# EAGLE design extpower (EAGLE 6.2)
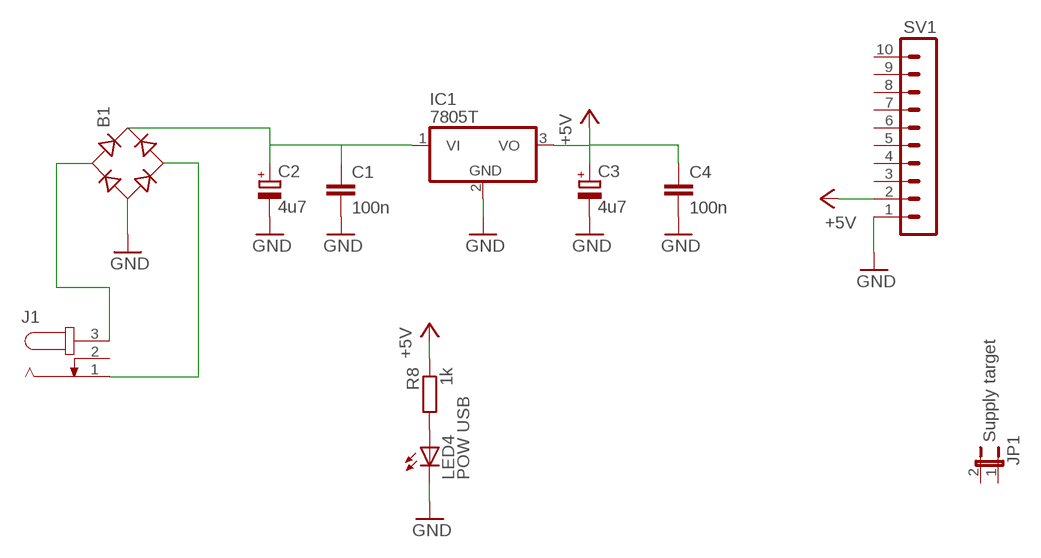
[diagram p0: schematic, sheet 1]

## Parts
B1  RB1A  [RB1A]
C1  100n  C-EU025-024X044  [C025-024X044]
C2  4u7  CPOL-EUTT2D5  [TT2D5]
C3  4u7  CPOL-EUTT2D5  [TT2D5]
C4  100n  C-EU025-024X044  [C025-024X044]
IC1  7805T  [TO220H]
J1  JACK-PLUG0  [SPC4077]
JP1  Supply target  JP1E  [JP1]
LED4  POW USB  LED3MM  [LED3MM]
R8  1k  R-EU_0207/10  [0207/10]
SV1  MA10-1W  [MA10-1W]

## Nets
+5V: C3.+ C4.1 IC1.3(VO) R8.1 SV1.2
GND: B1.- C1.2 C2.- C3.- C4.2 IC1.2(GND) LED4.K(C) SV1.1
N$1: B1.AC1 J1.3
N$2: B1.+ C1.1 C2.+ IC1.1(VI)
N$4: LED4.A R8.2
N$5: B1.AC2 J1.1
Unconnected: J1.2 JP1.1 JP1.2 SV1.3 SV1.4 SV1.5 SV1.6 SV1.7 SV1.8 SV1.9 SV1.10

## Library data of the parts
B1 = rectifier:RB1A: RECTIFIER 1 A
C1 C4 = rcl:C-EU: CAPACITOR, European symbol
C2 C3 = rcl:CPOL-EU: POLARIZED CAPACITOR, European symbol
IC1 = linear:78*: Positive VOLTAGE REGULATOR Source: http://cache.national.com/ds/LM/LM78L05.pdf http://www.fairchildsemi.com/ds/LM/LM7805.pdf
J1 = con-jack:JACK-PLUG: DC POWER JACK Power Jack, DC, Right Angle, Through Hole, Rated 5A at 16VDC, PC Terminals Distributor: Farnell (www.Farnell.de) Drawing: 84N1161.pdf / 84N1162.pdf Manufacturer: SPC Technology (www.spctechnology.com) Type: SPC4077 / SPC 4078
JP1 = jumper:JP1E: JUMPER
LED4 = led:LED: LED OSRAM: - CHIPLED LG R971, LG N971, LY N971, LG Q971, LY Q971, LO R971, LY R971 LH N974, LH R974 LS Q976, LO Q976, LY Q976 LO Q996 - Hyper CHIPLED LW Q18S LB Q993, LB Q99A, LB R99A - SideLED LS A670, LO A670, LY A670, LG A670, LP A670 LB A673, LV A673, LT A673, LW A673 LH A674 LY A675 LS A676, LA A676, LO A676, LY A676, LW A676 LS A679, LY A679, LG A679 - Hyper Micro SIDELED® LS Y876, LA Y876, LO Y876, LY Y876 LT Y87S - SmartLED LW L88C, LW L88S LB L89C, LB L89S, LG L890 LS L89K, LO L89K, LY L89K LS L896, LA L896, LO L896, LY L896 - TOPLED LS T670, LO T670, LY T670, LG T670, LP T670 LSG T670, LSP T670, LSY T670, LOP T670, LYG T670 LG T671, LOG T671, LSG T671 LB T673, LV T673, LT T673, LW T673 LH T674 LS T676, LA T676, LO T676, LY T676, LB T676, LH T676, LSB T676, LW T676 LB T67C, LV T67C, LT T67C, LS T67K, LO T67K, LY T67K, LW E67C LS E67B, LA E67B, LO E67B, LY E67B, LB E67C, LV E67C, LT E67C LW T67C LS T679, LY T679, LG T679 LS T770, LO T770, LY T770, LG T770, LP T770 LB T773, LV T773, LT T773, LW T773 LH T774 LS E675, LA E675, LY E675, LS T675 LS T776, LA T776, LO T776, LY T776, LB T776 LHGB T686 LT T68C, LB T68C - Hyper Mini TOPLED® LB M676 - Mini TOPLED Santana® LG M470 LS M47K, LO M47K, LY M47K Source: http://www.osram.convergy.de LUXEON: - LUMILED® LXK2-PW12-R00, LXK2-PW12-S00, LXK2-PW14-U00, LXK2-PW14-V00 LXK2-PM12-R00, LXK2-PM12-S00, LXK2-PM14-U00 LXK2-PE12-Q00, LXK2-PE12-R00, LXK2-PE12-S00, LXK2-PE14-T00, LXK2-PE14-U00 LXK2-PB12-K00, LXK2-PB12-L00, LXK2-PB12-M00, LXK2-PB14-N00, LXK2-PB14-P00, LXK2-PB14-Q00 LXK2-PR12-L00, LXK2-PR12-M00, LXK2-PR14-Q00, LXK2-PR14-R00 LXK2-PD12-Q00, LXK2-PD12-R00, LXK2-PD12-S00 LXK2-PH12-R00, LXK2-PH12-S00 LXK2-PL12-P00, LXK2-PL12-Q00, LXK2-PL12-R00 Source: www.luxeon.com KINGBRIGHT: KA-3528ASYC Source: www.kingbright.com
R8 = rcl:R-EU_: RESISTOR, European symbol
SV1 = con-lstb:MA10-1W: PIN HEADER

## Board
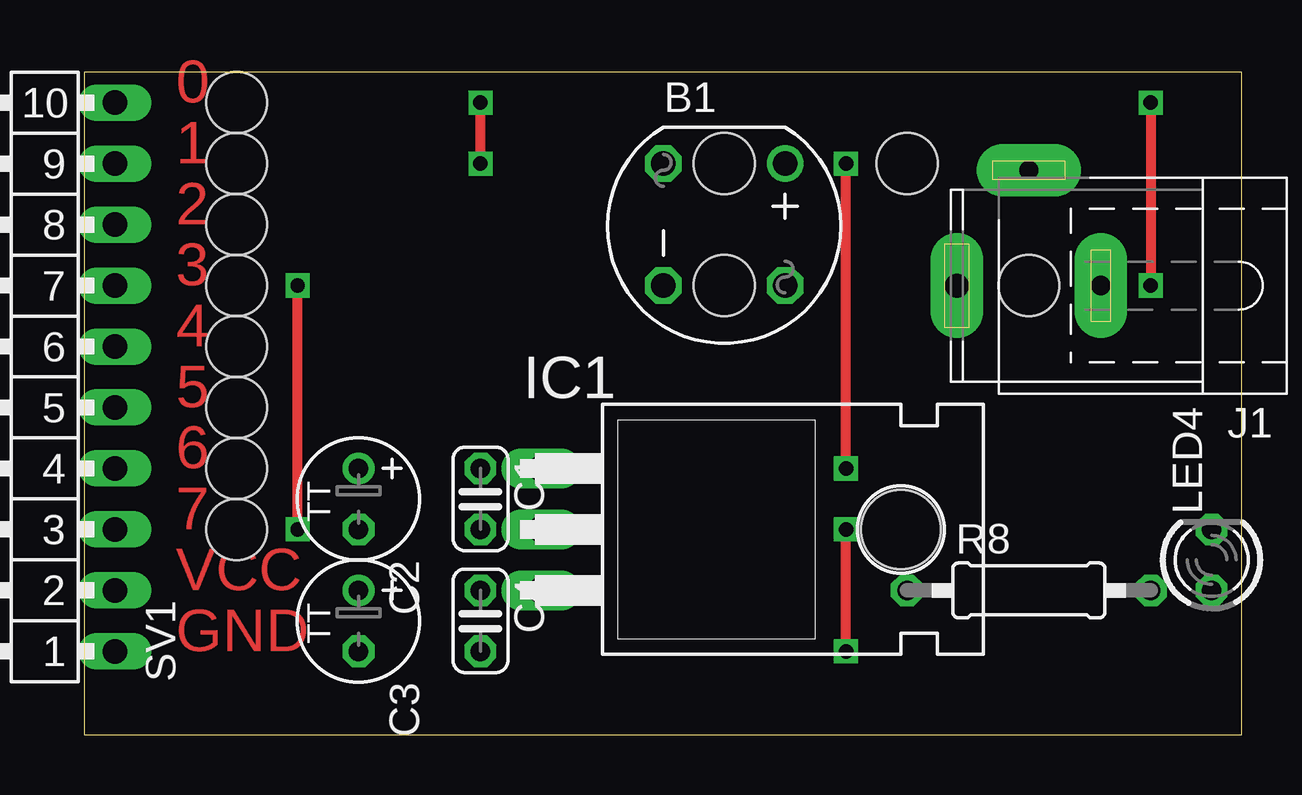
[diagram p1: board, top side]
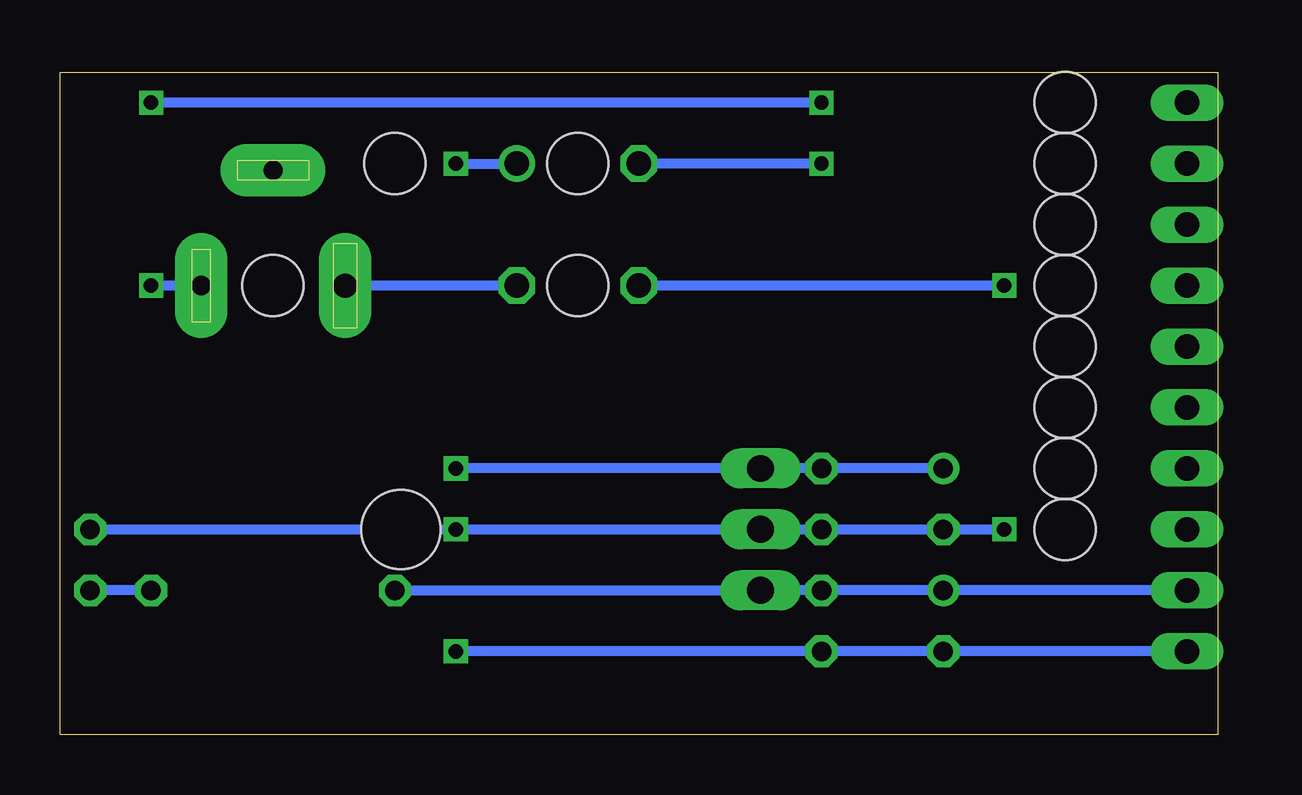
[diagram p2: board, bottom side, seen from below]

Size 48.25 x 27.61 mm. Coordinates in mm from the lower left corner, seen from the top.
Outline: 0,27.61 0,0 48.25,0 48.25,27.61 0,27.61
Copper layers (1*16): Top 0.035mm / dielectric 1.5mm / Bottom 0.035mm
Design rules: minimum track width 10mil, minimum drill 24mil, track to track 8mil, track to pad 8mil, pad to pad 8mil, via to via 8mil, smd to smd 8mil, copper to edge 40mil, drill to drill 8mil, minimum pad ring 10mil, minimum via ring 8mil, stop-mask expansion 4mil, vias tented up to drill 0mil, thermal gap 10mil
Holes 2.54 mm at 6.35,8.56 6.35,11.1 6.35,13.64 6.35,16.18 6.35,18.72 6.35,21.26 6.35,23.8 6.35,26.34 26.67,23.8 26.67,18.72 34.29,23.8 39.37,18.72

### Footprints (pad centres in the part's own frame; a part is rotated, then mirrored left to right if it is on the bottom)
RB1A = drill 1.016: + -2.54,2.54 | drill 1.016 octagon: - 2.54,-2.54; AC1 2.54,2.54; AC2 -2.54,-2.54
C025-024X044 = drill 0.813 octagon: 1 -1.27,0; 2 1.27,0
TT2D5 = drill 0.813: + -1.27,0 | drill 0.813 octagon: - 1.27,0
TO220H = drill 1.118 long: 1 -2.54,-10.16; 2 0,-10.16; 3 2.54,-10.16 | hole 3.302: 0,4.826
SPC4077 = drill 0.8 pad 2.184 long: 1 -3,0; 2 0,-4.8 | drill 1 pad 2.184 long: 3 3,0
JP1 = drill 0.914 long: 1 0,-1.27; 2 0,1.27
LED3MM = drill 0.813 octagon: A -1.27,0; K 1.27,0
0207/10 = drill 0.813 octagon: 1 -5.08,0; 2 5.08,0
MA10-1W = drill 1.016 long: 1 -11.43,0; 2 -8.89,0; 3 -6.35,0; 4 -3.81,0; 5 -1.27,0; 6 1.27,0; 7 3.81,0; 8 6.35,0; 9 8.89,0; 10 11.43,0

### Placement (x,y rotation side)
B1  26.67,21.26 270 top
C1  16.51,9.83 270 top
C2  11.43,9.83 270 top
C3  11.43,4.75 270 top
C4  16.51,4.75 270 top
IC1  29.21,8.56 270 top
J1  39.37,18.72 180 top
JP1  59.69,25.07 180 top  (outside the outline)
LED4  46.99,7.29 90 top
R8  39.37,6.02 0 top
SV1  1.27,14.91 90 top

### Tracks (layer width: path | path; a pad name or v marks a point on that pad's centre or on a via)
+5V
  Bottom 0.406: SV1.2 C3.+ C4.1 IC1.3 R8.1
GND  (via drill 0.6)
  Top 0.406: v31.75,3.48 v31.75,8.56 | v8.89,8.56 v8.89,18.72
  Bottom 0.406: SV1.1 C3.- C4.2 v31.75,3.48 | v8.89,18.72 B1.- | v8.89,8.56 C2.- C1.2 IC1.2 v31.75,8.56 LED4.K
N$1
  Bottom 0.406: B1.AC1 J1.3
N$2  (via drill 0.6)
  Top 0.406: v31.75,11.1 v31.75,23.8
  Bottom 0.406: v31.75,23.8 B1.+ | C2.+ C1.1 IC1.1 v31.75,11.1
N$4
  Bottom 0.406: R8.2 LED4.A
N$5  (via drill 0.6)
  Top 0.406: v16.51,23.8 v16.51,26.34 | v44.45,26.34 v44.45,18.72
  Bottom 0.406: v16.51,23.8 B1.AC2 | v16.51,26.34 v44.45,26.34 | v44.45,18.72 J1.1 41.91,18.72

### Text on the board
Top: 0 | 1 | 2 | 3 | 4 | 5 | 6 | 7 | VCC | GND